# Altium schematic sheet blaster.SchDoc
size A4; DrawnBy: Joachim Löfwander; Revision: REV1; SheetNumber: 1; SheetTotal: 2
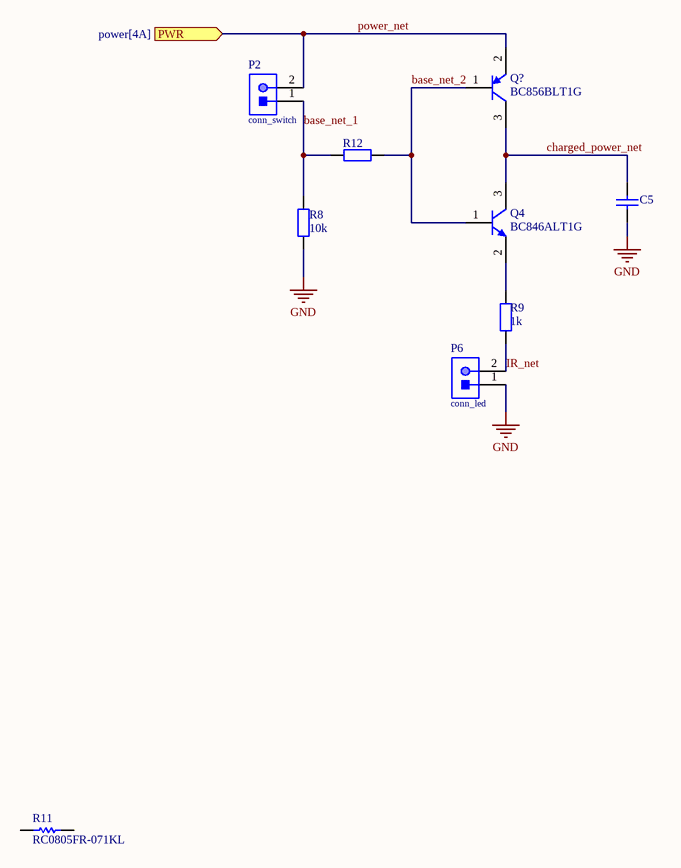
[diagram p0: blaster.SchDoc]

## Parts
C5  GRM21BR71A106KE51L  [CAPC2013X140X45NL15T25]  (value not drawn)
P2  conn_switch  [61300211121]
P6  conn_led  [61300211121]
Q4  BC846ALT1G  [ONSC-SOT-23-3-318-08_V]
Q?  BC856BLT1G  [ONSC-SOT-23-3-318-08_V]
R8  10k  [RESC2013X55X40ML15T20]
R9  1k  [RESC2013X55X40LL15T20]
R11  RC0805FR-071KL  [RESC2013X60X35ML10T20]
R12  CRCW08051K00FKEA  [RESC2013X50X30ML20T20]  (value not drawn)

## Ports
PWR (in, see power[4A])

## Nets
GND: C5.1 P6.1 R8.1
base_net_1: P2.1 R8.2 R12.2
base_net_2: Q4.1(B) Q?.1(B) R12.1
charged_power_net: C5.2 Q4.3(C) Q?.3(C)
IR_net: P6.2 R9.1
power_net: P2.2 Q?.2(E) ; port PWR
NetQ4_2: Q4.2(E) R9.2

Not connected (* = marked no-connect by the designer): R11 1 2

## Library data of the parts
C5 = CMP-2007-03395-1: Manufacturer: Murata; Part Number: GRM21BR71A106KE51L
P2 P6 = CMP-1712-00002-4: THT Vertical Pin Header WR-PHD, Pitch 2.54 mm, Single Row, 2 pins; Manufacturer: Wurth Elektronik; Rated Current: 3A; Gender: Male; Withstanding Voltage: 500VAC; Working Voltage: 250VAC; Pitch: 2.54mm; Contact Resistance: 20mOhm; Pin Number: 2; Mounting Technology: THT; Orientation: Vertical; Operating Temperature: -40to105degC; Packaging: Bag; Publisher: WurthElektronik; Datasheet URL: https://katalog.we-online.de/em/datasheet/6130xx11121.pdf; Manufacturer URL: http://www.we-online.de; Row Number: Single; Package Reference: 61300211121; Part Number: 61300211121
Q4 = CMP-1048-00774-1: General Purpose Transistor, NPN Silicon, 3-Pin SOT-23, Pb-Free, Tape and Reel; Manufacturer: On Semiconductor; fT Min (MHz): 100; IC Continuous (A): 0.1; Polarity: NPN; PackageVersion: Rev. AP, 11/2009; RoHS: TRUE; ComponentLink1URL: http://www.onsemi.com/; DatasheetVersion: Rev. 11; ComponentLink3URL: http://www.onsemi.cn/pub_link/Collateral/318-08.PDF; Mounting Technology: Surface Mount; ComponentLink2Description: Datasheet; PartNumber: BC846ALT1G; ComponentLink1Description: Manufacturer URL; ComponentLink3Description: Package Specification; PackageReference: SOT-23-3-318-08; ComponentLink2URL: http://www.onsemi.cn/pub_link/Collateral/BC846ALT1-D.PDF; PackageDescription: 3-Pin Small Outline Transistor, Body 2.92 x 1.3 mm, Pitch 0.95 mm; Packing: Tape and Reel
Q? = CMP-1048-00715-1: General Purpose Transistor, PNP Silicon, 3-Pin SOT-23, Pb-Free, Tape and Reel; Manufacturer: On Semiconductor; fT Min (MHz): 100; IC Continuous (A): -0.1; Packing: Tape and Reel; RoHS: TRUE; PackageReference: SOT-23-3-318-08; PackageVersion: Rev. AP, 11/2009; PartNumber: BC856BLT1G; ComponentLink1Description: Manufacturer URL; ComponentLink1URL: http://www.onsemi.com/; ComponentLink3URL: http://www.onsemi.cn/pub_link/Collateral/318-08.PDF; PackageDescription: 3-Pin Small Outline Transistor, Body 2.92 x 1.3 mm, Pitch 0.95 mm; Mounting Technology: Surface Mount; ComponentLink3Description: Package Specification; ComponentLink2Description: Datasheet; DatasheetVersion: Rev. 13; ComponentLink2URL: http://www.onsemi.cn/pub_link/Collateral/BC856ALT1-D.PDF; Polarity: PNP
R8 = CMP-2001-04725-1: Part Number: TNPW080510K0BEEN; Manufacturer: Vishay Dale
R9 = CMP-2001-04738-1: Part Number: TNPW08051K00BEEN; Manufacturer: Vishay Dale
R11 = CMP-2100-03671-1: Chip Resistor, 1 KOhm, +/- 1%, 125 mW, -55 to 155 degC, 0805 (2012 Metric), RoHS, Tape and Reel; Manufacturer: Yageo; Temperature Coefficient: 100ppm/degreesC; Voltage Rating (DC): 150V; Max Power Dissipation: 125mW; Resistance: 1KOhm; Number of Pins: 2; Number of Terminations: 2; Datasheet URL: http://www.yageo.com/NewPortal/yageodocoutput?fileName=/pdf/R-Chip/PYu-RC_Group_51_RoHS_L_5.pdf; Length: 0.079inch; Package Description: 2-Pin Surface Mounted Device, Body 2 x 1.25 mm; Depth: 1.25mm; Height: 0.024inch; Military Standard: Not; Case/Package: 0805; Package Reference: 0805; RoHSCompliant: true; Lead Free: LeadFree; Packaging: TapeandReel; Package Quantity: 1; Datasheet Version: Rev. 5, 10/2016; Tolerance: 1%; Min Operating Temperature: -55degC; Voltage Rating: 150V; Composition: ThickFilm; Case Code (Imperial): 0805; Power Rating: 125mW; Width: 0.049inch; Case Code (Metric): 2012; Manufacturer URL: http://www.yageo.com/; Max Operating Temperature: 155degC; REACH SVHC: Unknown; Termination: SMD/SMT
R12 = CMP-1013-00510-2: Manufacturer: Vishay Dale; Part Number: CRCW08051K00FKEA